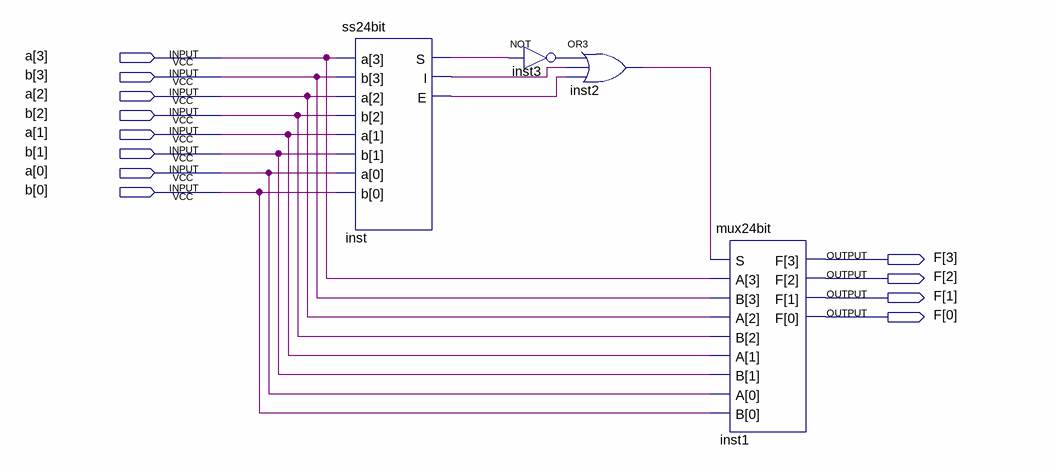
[diagram p0: schematic sheet]
// Quartus schematic cau1.bdf as structural Verilog: 4 symbols, 12 pins
module cau1 (
  input  [3:0] a,
  input  [3:0] b,
  output [3:0] F
);

  wire inst2_out, inst3_out, inst_e, inst_i, inst_s;

  ss24bit inst (.a(a), .b(b), .S(inst_s), .I(inst_i), .E(inst_e));
  or inst2 (inst2_out, inst3_out, inst_i, inst_e);
  not inst3 (inst3_out, inst_s);
  mux24bit inst1 (.S(inst2_out), .A(a), .B(b), .F(F));
endmodule
